# Altium schematic sheet TopLevelWiring.SchDoc
size A4; PageSetup: Record=PageOptions|CenterHorizontal=True|CenterVertical=True|PrintScale=1.00|XCorrection=1.00|YCorrection=1.00|PrintKind=0|BorderSize=5000000|LeftOffset=0|BottomOffset=0|Orientation=2|PaperLength=1000|PaperWidth=1000|Scale=100|PaperSource=7|PrintQuality=-3|MediaType=1|DitherType=10|PrintScaleMode=1|PaperKind=A4|PaperIndex=9
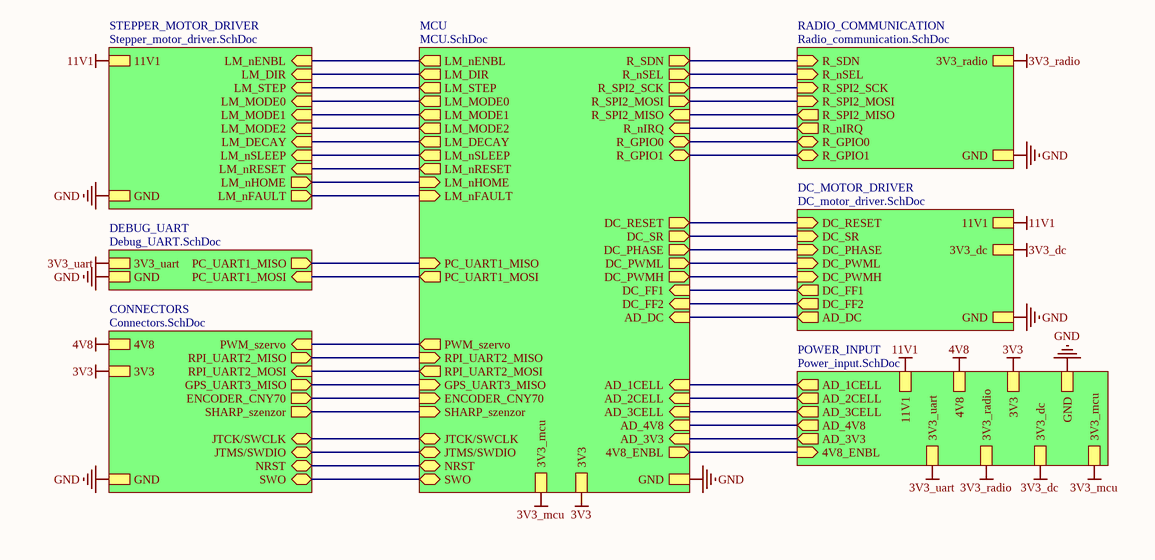
[diagram p0: TopLevelWiring.SchDoc]

## Sub-sheets
CONNECTORS = Connectors.SchDoc: PWM_szervo (in), GND, 4V8, 3V3, RPI_UART2_MOSI (in), RPI_UART2_MISO (out), GPS_UART3_MISO (out), JTCK/SWCLK (bidir), JTMS/SWDIO (bidir), NRST (bidir), ENCODER_CNY70 (out), SWO (bidir), SHARP_szenzor (out)
DC_MOTOR_DRIVER = DC_motor_driver.SchDoc: 11V1, GND, DC_RESET (in), DC_SR (in), DC_PHASE (in), DC_PWML (in), DC_PWMH (in), DC_FF1 (out), DC_FF2 (out), AD_DC (out), 3V3_dc
DEBUG_UART = Debug_UART.SchDoc: 3V3_uart, GND, PC_UART1_MOSI (in), PC_UART1_MISO (out)
MCU = MCU.SchDoc: GND, LM_nENBL (out), LM_DIR (out), LM_STEP (out), LM_MODE0 (out), LM_MODE1 (out), LM_MODE2 (out), LM_DECAY (out), LM_nSLEEP (out), LM_nRESET (out), LM_nHOME (in), LM_nFAULT (in), R_SDN (out), R_nSEL (out), R_GPIO0 (bidir), R_GPIO1 (bidir), R_nIRQ (in), R_SPI2_SCK (out), R_SPI2_MISO (in), R_SPI2_MOSI (out), RPI_UART2_MOSI (out), RPI_UART2_MISO (in), GPS_UART3_MISO (in), PC_UART1_MOSI (out), PC_UART1_MISO (in), JTCK/SWCLK (bidir), JTMS/SWDIO (bidir), NRST (bidir), DC_RESET (out), DC_SR (out), DC_PHASE (out), DC_PWML (out), DC_PWMH (out), DC_FF1 (in), DC_FF2 (in), SWO (bidir), AD_3CELL (in), AD_4V8 (in), AD_3V3 (in), AD_2CELL (in), AD_1CELL (in), AD_DC (in), ENCODER_CNY70 (in), PWM_szervo (out), 4V8_ENBL (out), 3V3_mcu, 3V3, SHARP_szenzor (in)
POWER_INPUT = Power_input.SchDoc: 3V3, 4V8, 11V1, GND, AD_3CELL (out), AD_4V8 (out), AD_3V3 (out), AD_2CELL (out), AD_1CELL (out), 3V3_dc, 3V3_radio, 3V3_uart, 3V3_mcu, 4V8_ENBL (in)
RADIO_COMMUNICATION = Radio_communication.SchDoc: GND, R_SDN (in), R_nSEL (in), R_GPIO0 (bidir), R_GPIO1 (bidir), R_nIRQ (out), 3V3_radio, R_SPI2_SCK (in), R_SPI2_MISO (out), R_SPI2_MOSI (in)
STEPPER_MOTOR_DRIVER = Stepper_motor_driver.SchDoc: GND, LM_nENBL (in), LM_DIR (in), LM_STEP (in), LM_MODE0 (in), LM_MODE1 (in), LM_MODE2 (in), LM_DECAY (in), LM_nSLEEP (in), LM_nRESET (in), LM_nHOME (out), LM_nFAULT (out), 11V1

## Nets
3V3: sheet CONNECTORS/3V3, sheet POWER_INPUT/3V3, sheet MCU/3V3
3V3_dc: sheet DC_MOTOR_DRIVER/3V3_dc, sheet POWER_INPUT/3V3_dc
3V3_mcu: sheet POWER_INPUT/3V3_mcu, sheet MCU/3V3_mcu
3V3_radio: sheet RADIO_COMMUNICATION/3V3_radio, sheet POWER_INPUT/3V3_radio
3V3_uart: sheet DEBUG_UART/3V3_uart, sheet POWER_INPUT/3V3_uart
4V8: sheet CONNECTORS/4V8, sheet POWER_INPUT/4V8
11V1: sheet DC_MOTOR_DRIVER/11V1, sheet STEPPER_MOTOR_DRIVER/11V1, sheet POWER_INPUT/11V1
GND: sheet CONNECTORS/GND, sheet DC_MOTOR_DRIVER/GND, sheet DEBUG_UART/GND, sheet RADIO_COMMUNICATION/GND, sheet STEPPER_MOTOR_DRIVER/GND, sheet POWER_INPUT/GND, sheet MCU/GND
(unnamed): sheet CONNECTORS/PWM_szervo, sheet MCU/PWM_szervo
(unnamed): sheet CONNECTORS/RPI_UART2_MOSI, sheet MCU/RPI_UART2_MOSI
(unnamed): sheet CONNECTORS/RPI_UART2_MISO, sheet MCU/RPI_UART2_MISO
(unnamed): sheet CONNECTORS/GPS_UART3_MISO, sheet MCU/GPS_UART3_MISO
(unnamed): sheet CONNECTORS/JTCK/SWCLK, sheet MCU/JTCK/SWCLK
(unnamed): sheet CONNECTORS/JTMS/SWDIO, sheet MCU/JTMS/SWDIO
(unnamed): sheet CONNECTORS/NRST, sheet MCU/NRST
(unnamed): sheet CONNECTORS/ENCODER_CNY70, sheet MCU/ENCODER_CNY70
(unnamed): sheet CONNECTORS/SWO, sheet MCU/SWO
(unnamed): sheet CONNECTORS/SHARP_szenzor, sheet MCU/SHARP_szenzor
(unnamed): sheet DC_MOTOR_DRIVER/DC_RESET, sheet MCU/DC_RESET
(unnamed): sheet DC_MOTOR_DRIVER/DC_SR, sheet MCU/DC_SR
(unnamed): sheet DC_MOTOR_DRIVER/DC_PHASE, sheet MCU/DC_PHASE
(unnamed): sheet DC_MOTOR_DRIVER/DC_PWML, sheet MCU/DC_PWML
(unnamed): sheet DC_MOTOR_DRIVER/DC_PWMH, sheet MCU/DC_PWMH
(unnamed): sheet DC_MOTOR_DRIVER/DC_FF1, sheet MCU/DC_FF1
(unnamed): sheet DC_MOTOR_DRIVER/DC_FF2, sheet MCU/DC_FF2
(unnamed): sheet DC_MOTOR_DRIVER/AD_DC, sheet MCU/AD_DC
(unnamed): sheet DEBUG_UART/PC_UART1_MOSI, sheet MCU/PC_UART1_MOSI
(unnamed): sheet DEBUG_UART/PC_UART1_MISO, sheet MCU/PC_UART1_MISO
(unnamed): sheet RADIO_COMMUNICATION/R_SDN, sheet MCU/R_SDN
(unnamed): sheet RADIO_COMMUNICATION/R_nSEL, sheet MCU/R_nSEL
(unnamed): sheet RADIO_COMMUNICATION/R_GPIO0, sheet MCU/R_GPIO0
(unnamed): sheet RADIO_COMMUNICATION/R_GPIO1, sheet MCU/R_GPIO1
(unnamed): sheet RADIO_COMMUNICATION/R_nIRQ, sheet MCU/R_nIRQ
(unnamed): sheet RADIO_COMMUNICATION/R_SPI2_SCK, sheet MCU/R_SPI2_SCK
(unnamed): sheet RADIO_COMMUNICATION/R_SPI2_MISO, sheet MCU/R_SPI2_MISO
(unnamed): sheet RADIO_COMMUNICATION/R_SPI2_MOSI, sheet MCU/R_SPI2_MOSI
(unnamed): sheet STEPPER_MOTOR_DRIVER/LM_nENBL, sheet MCU/LM_nENBL
(unnamed): sheet STEPPER_MOTOR_DRIVER/LM_DIR, sheet MCU/LM_DIR
(unnamed): sheet STEPPER_MOTOR_DRIVER/LM_STEP, sheet MCU/LM_STEP
(unnamed): sheet STEPPER_MOTOR_DRIVER/LM_MODE0, sheet MCU/LM_MODE0
(unnamed): sheet STEPPER_MOTOR_DRIVER/LM_MODE1, sheet MCU/LM_MODE1
(unnamed): sheet STEPPER_MOTOR_DRIVER/LM_MODE2, sheet MCU/LM_MODE2
(unnamed): sheet STEPPER_MOTOR_DRIVER/LM_DECAY, sheet MCU/LM_DECAY
(unnamed): sheet STEPPER_MOTOR_DRIVER/LM_nSLEEP, sheet MCU/LM_nSLEEP
(unnamed): sheet STEPPER_MOTOR_DRIVER/LM_nRESET, sheet MCU/LM_nRESET
(unnamed): sheet STEPPER_MOTOR_DRIVER/LM_nHOME, sheet MCU/LM_nHOME
(unnamed): sheet STEPPER_MOTOR_DRIVER/LM_nFAULT, sheet MCU/LM_nFAULT
(unnamed): sheet POWER_INPUT/AD_3CELL, sheet MCU/AD_3CELL
(unnamed): sheet POWER_INPUT/AD_4V8, sheet MCU/AD_4V8
(unnamed): sheet POWER_INPUT/AD_3V3, sheet MCU/AD_3V3
(unnamed): sheet POWER_INPUT/AD_2CELL, sheet MCU/AD_2CELL
(unnamed): sheet POWER_INPUT/AD_1CELL, sheet MCU/AD_1CELL
(unnamed): sheet POWER_INPUT/4V8_ENBL, sheet MCU/4V8_ENBL